# Altium project Labo APP5.PrjPcb
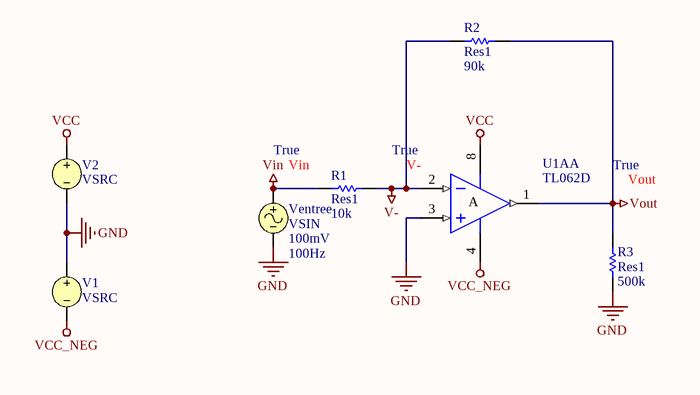
[diagram p0: 13.6.SchDoc]
1 sheet, 7 parts. Net scope: global (net labels, ports and power ports of the same name join across sheets).

## Sheet 13.6.SchDoc
size A4; SheetNumber: 1; SheetTotal: 1

### Parts
R1  Res1  value 10k  [AXIAL-0.3]
R2  Res1  value 90k  [AXIAL-0.3]
R3  Res1  value 500k  [AXIAL-0.3]
U1A  TL062D  [D008_L]  (part A of 2)
V1  VSRC
V2  VSRC
Ventree  VSIN  Amplitude: 100mV  Frequency: 100Hz

### Nets
GND: R3.1 U1A.3(IN+) V1.1 V2.2 Ventree.2
V-: R1.2 R2.1 U1A.2(IN-)
VCC: U1A.8(V+) V2.1
VCC_NEG: U1A.4(V-) V1.2
Vin: R1.1 Ventree.1
Vout: R2.2 R3.2 U1A.1(OUT)

### Notes on the sheet
- (in symbol TL062D, part A) A

### Library data of the parts
R1-R3 = Res1: Resistor; Published: 8-Jun-2000; LatestRevisionDate: 17-Jul-2002; LatestRevisionNote: Re-released for DXP Platform.; PackageReference: AXIAL-0.3; Publisher: Altium Limited; PackageDescription: Axial Device, Thru-Hole; 2 Leads; 0.3 in Pin Spacing
U1A = TL062D: Low-Power JFET-Input Operational Amplifier; Published: 16-Jan-2001; LatestRevisionDate: 13-Apr-2006; LatestRevisionNote: IPC-7351 Footprint Added.; DatasheetVersion: Jan-1999; PackageVersion: Jan-1998; PackageReference: D008; Publisher: Altium Limited; PackageDescription: 8-Pin Small Outline Integrated Circuit 1.27 mm Pitch; Code_IPC: SOIC127P600-8; ComponentLink1Description: Manufacturer Link; ComponentLink1URL: http://www.ti.com/; ComponentLink2Description: Datasheet; ComponentLink2URL: http://www-s.ti.com/sc/ds/tl062.pdf
V1 V2 = VSRC: Voltage Source; Note: PCB Footprint - Not required; Value: 15; Published: 8-Jun-2000; LatestRevisionDate: 17-Jul-2002; LatestRevisionNote: Re-released for DXP Platform.; PackageReference: Not Applicable; Publisher: Altium Limited
Ventree = VSIN: Sinusoidal Voltage Source; Note: PCB Footprint - Not required; Offset: 0; AC Magnitude: 1; Published: 8-Jun-2000; LatestRevisionDate: 15-Nov-2004; LatestRevisionNote: Corrected Netlist.; PackageReference: Not Applicable; Publisher: Altium Limited; Delay: 0; Damping Factor: 0; Phase: 0; DC Magnitude: 0; AC Phase: 0